# Altium schematic sheet heater.SchDoc
size A4
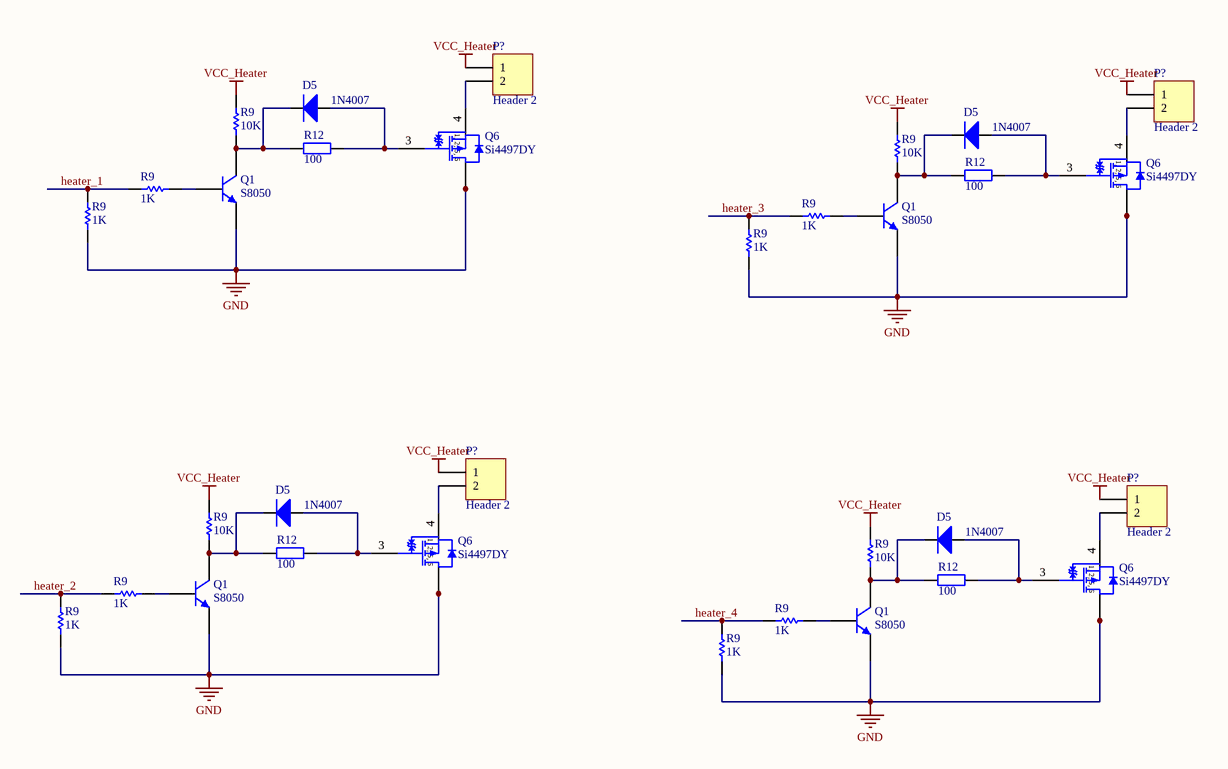
[diagram p0: heater.SchDoc]

## Parts
(Parts that share a designator on the sheet are numbered #1, #2 ... from top to bottom, then left to right.)
D5#1  1N4007  [DO-214-AC]
D5#2  1N4007  [DO-214-AC]
D5#3  1N4007  [DO-214-AC]
D5#4  1N4007  [DO-214-AC]
P?#1  Header 2  [HDR1X2]
P?#2  Header 2  [HDR1X2]
P?#3  Header 2  [HDR1X2]
P?#4  Header 2  [HDR1X2]
Q1#1  S8050  [SOT23-3]
Q1#2  S8050  [SOT23-3]
Q1#3  S8050  [SOT23-3]
Q1#4  S8050  [SOT23-3]
Q6#1  Si4497DY
Q6#2  Si4497DY
Q6#3  Si4497DY
Q6#4  Si4497DY
R9#1  10K  [0603R]
R9#2  10K  [0603R]
R9#3  1K  [0603R]
R9#4  1K  [0603R]
R9#5  1K  [0603R]
R9#6  1K  [0603R]
R9#7  10K  [0603R]
R9#8  10K  [0603R]
R9#9  1K  [0603R]
R9#10  1K  [0603R]
R9#11  1K  [0603R]
R9#12  1K  [0603R]
R12#1  100  [SMD-0603]
R12#2  100  [SMD-0603]
R12#3  100  [SMD-0603]
R12#4  100  [SMD-0603]

## Nets
GND: Q1#1.2(E) Q1#2.2(E) Q1#3.2(E) Q1#4.2(E) Q6#1.1(D) Q6#1.2(D) Q6#1.5(D) Q6#1.6(D) Q6#2.1(D) Q6#2.2(D) Q6#2.5(D) Q6#2.6(D) Q6#3.1(D) Q6#3.2(D) Q6#3.5(D) Q6#3.6(D) Q6#4.1(D) Q6#4.2(D) Q6#4.5(D) Q6#4.6(D) R9#3.2 R9#5.2 R9#9.2 R9#11.2
VCC_Heater: P?#1.1 P?#2.1 P?#3.1 P?#4.1 R9#1.2 R9#2.2 R9#7.2 R9#8.2
heater_1: R9#3.1 R9#4.2
heater_2: R9#9.1 R9#10.2
heater_3: R9#5.1 R9#6.2
heater_4: R9#11.1 R9#12.2
NetD5#1_1: D5#1.1(A) Q6#1.3(G) R12#1.2
NetD5#1_2: D5#1.2(K) Q1#1.3(C) R9#1.1 R12#1.1
NetD5#2_1: D5#2.1(A) Q6#2.3(G) R12#2.2
NetD5#2_2: D5#2.2(K) Q1#2.3(C) R9#2.1 R12#2.1
NetD5#3_1: D5#3.1(A) Q6#3.3(G) R12#3.2
NetD5#3_2: D5#3.2(K) Q1#3.3(C) R9#7.1 R12#3.1
NetD5#4_1: D5#4.1(A) Q6#4.3(G) R12#4.2
NetD5#4_2: D5#4.2(K) Q1#4.3(C) R9#8.1 R12#4.1
NetP?#1_2: P?#1.2 Q6#1.4(S)
NetP?#2_2: P?#2.2 Q6#2.4(S)
NetP?#3_2: P?#3.2 Q6#3.4(S)
NetP?#4_2: P?#4.2 Q6#4.4(S)
NetQ1#1_1: Q1#1.1(B) R9#4.1
NetQ1#2_1: Q1#2.1(B) R9#6.1
NetQ1#3_1: Q1#3.1(B) R9#10.1
NetQ1#4_1: Q1#4.1(B) R9#12.1

## Notes on the sheet
- (in symbol SQ3419AEEV-T1_GE3) 1, 2, 5, 6

## Library data of the parts
D5#1-D5#4 = DIODE2: 贴片二极管
P?#1-P?#4 = Header 2: Header, 2-Pin; LatestRevisionDate: 17-Jul-2002; LatestRevisionNote: Re-released for DXP Platform.; Publisher: Altium Limited
Q1#1-Q1#4 = NPN: NPN Bipolar Transistor; Published: 8-Jun-2000; LatestRevisionDate: 17-Jul-2002; LatestRevisionNote: Re-released for DXP Platform.; PackageReference: TO-226; Publisher: Altium Limited; Code_JEDEC: TO-226-AA
Q6#1-Q6#4 = SQ3419AEEV-T1_GE3: Automotive P-Channel MOSFET, 6.9 A, 40 V, -55 to 175 degC, 6-Pin TSOP, RoHS, Tape and Reel; Manufacturer: International Rectifier; Rated Power Dissipation: 2W; Qg Gate Charge: 25nC; Drain-to-Source Voltage [Vdss]: 40V; Drain-Source On Resistance-Max: 112mO; Channel Type: P-Channel; Package Description: 6-Pin Thin Small Outline Package, Body 3 x 1.65 mm, Pitch 1.00 mm; Datasheet URL: https://www.vishay.com/docs/65332/sq3419aeev.pdf; Mounting Technology: SurfaceMount; Package Reference: TSOP-6; Manufacturer URL: https://www.vishay.com/; Datasheet Version: 04/2010
R9#1-R9#12 = Res1: Resistor; Published: 8-Jun-2000; LatestRevisionDate: 17-Jul-2002; LatestRevisionNote: Re-released for DXP Platform.; PackageReference: AXIAL-0.3; Publisher: Altium Limited
R12#1-R12#4 = RES-SOP: 贴片电阻 5%